# EAGLE design nrf24L01Shield (EAGLE 7.1.0)
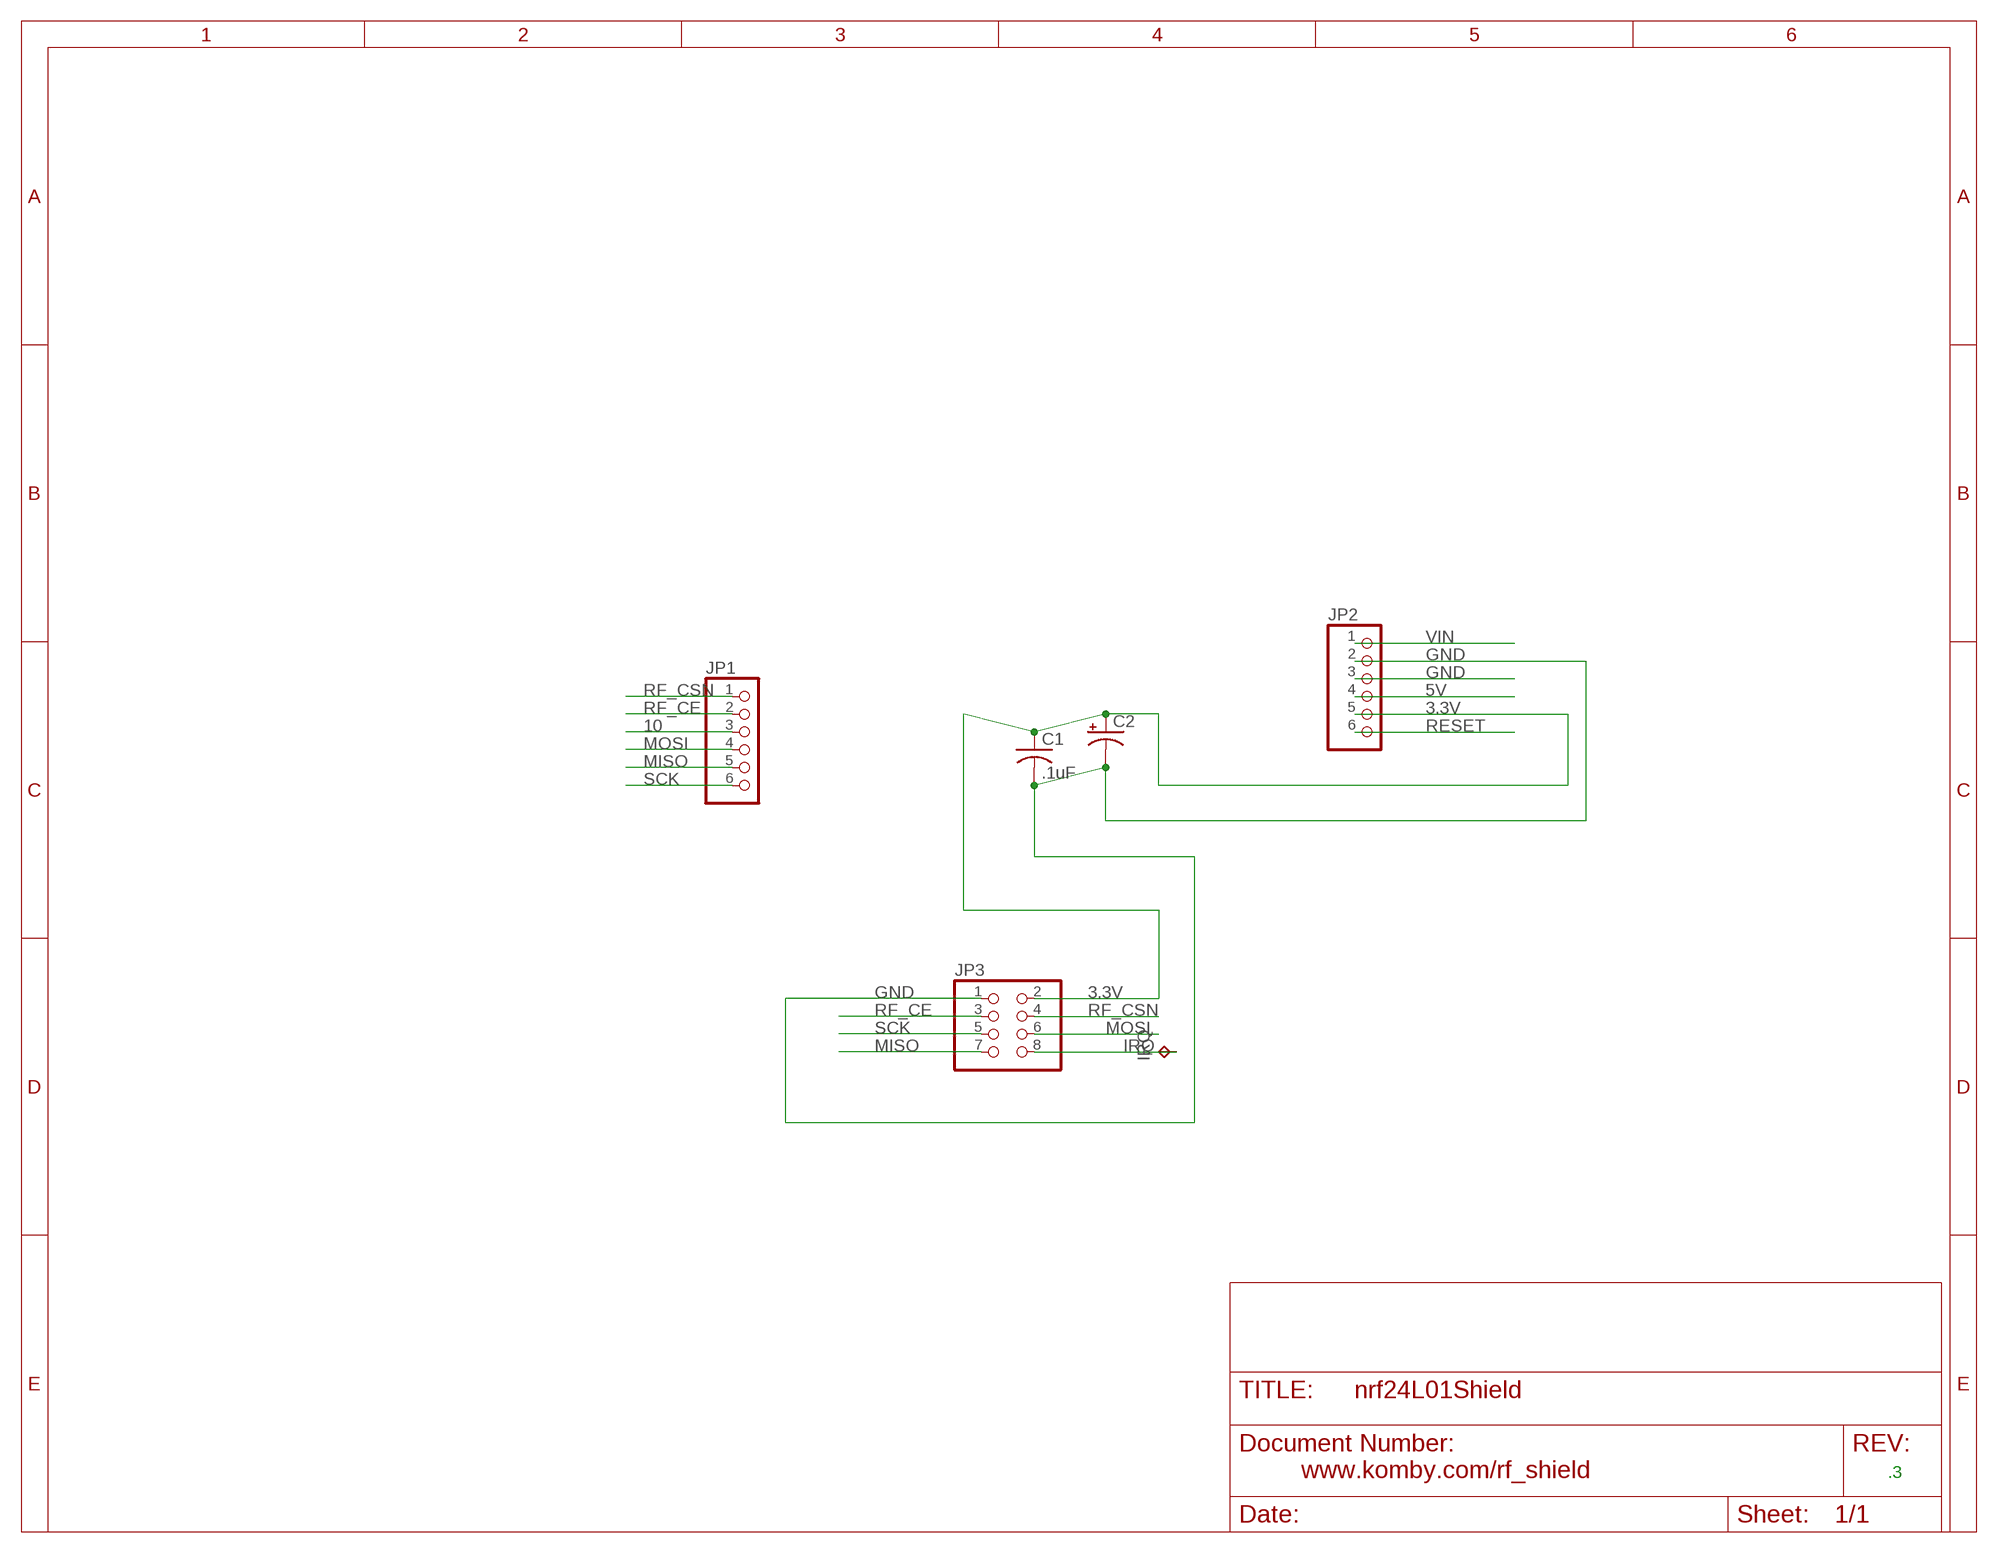
[diagram p0: schematic, sheet 1]

## Parts
C1  .1uF  C-US025-024X044  [C025-024X044]
C2  CPOL-USE2.5-6  [E2,5-6]
IRQ  IRQ  TPPAD1-13  [P1-13]
JP1  PINHD-1X6B  [1X06-BIG]
JP2  PINHD-1X6B  [1X06-BIG]
JP3  PINHD-2X4  [2X04]

## Nets
3.3V [RFBoard]: C1.1 C2.+ JP2.5 JP3.2
5V [RFBoard]: JP2.4
10 [RFBoard]: JP1.3
GND [RFBoard]: C1.2 C2.- JP2.2 JP2.3 JP3.1
IRQ: IRQ.TP JP3.8
MISO [RFBoard]: JP1.5 JP3.7
MOSI [RFBoard]: JP1.4 JP3.6
RESET [RFBoard]: JP2.6
RF_CE [RFBoard]: JP1.2 JP3.3
RF_CSN [RFBoard]: JP1.1 JP3.4
SCK [RFBoard]: JP1.6 JP3.5
VIN [RFBoard]: JP2.1

## Notes on the sheet
- www.komby.com/rf_shield | .3

## Library data of the parts
C1 = adafruit:C-US: CAPACITOR, American symbol
C2 = adafruit:CPOL-US: POLARIZED CAPACITOR, American symbol
IRQ = testpad:TP: Test pad
JP1 JP2 = adafruit:PINHD-1X6: PIN HEADER
JP3 = adafruit:PINHD-2X4: PIN HEADER

## Net classes
1 RFBoard: width 0.406 mm

## Board
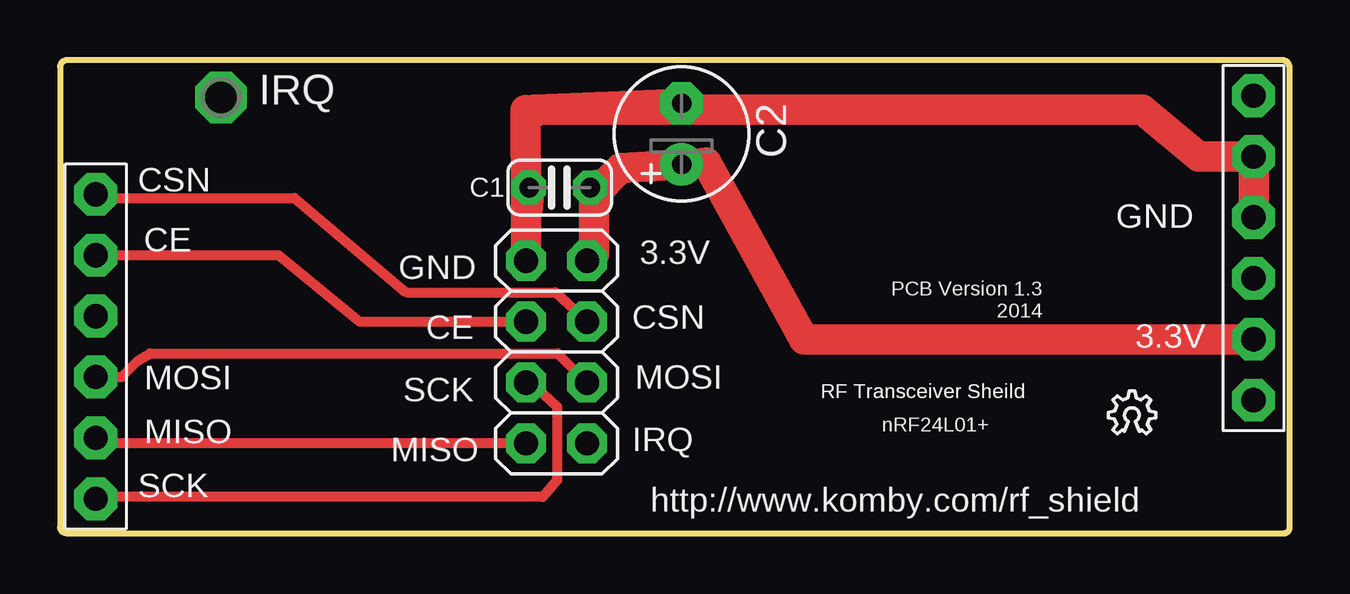
[diagram p1: board, top side]
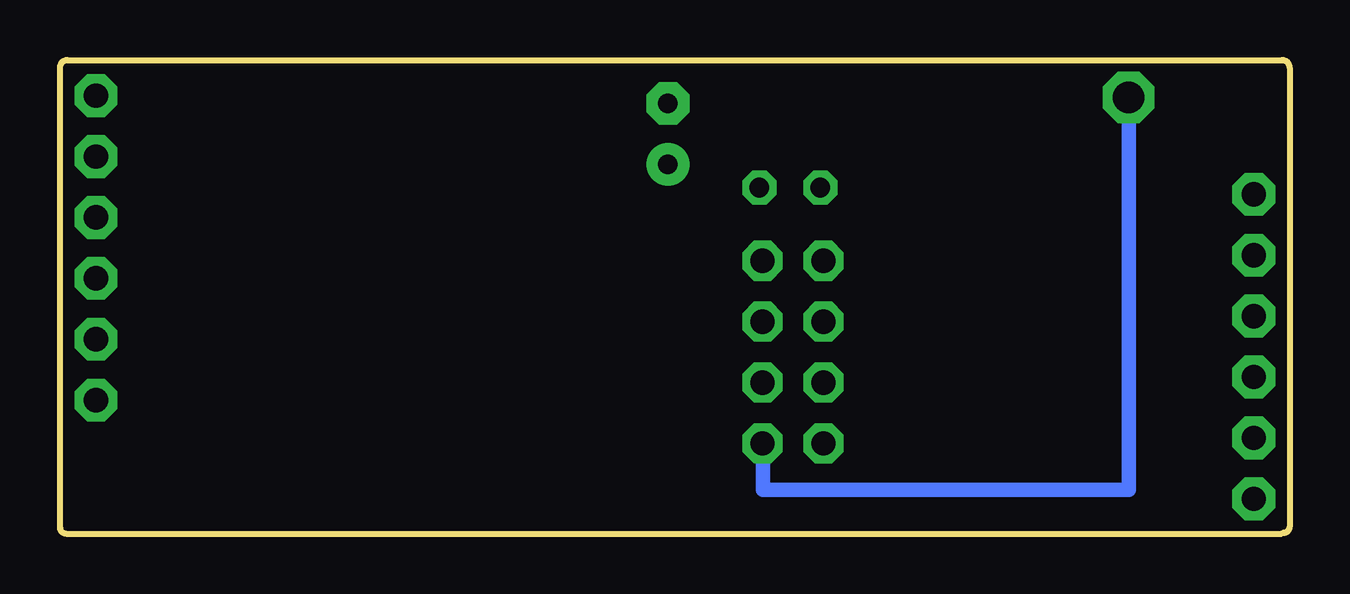
[diagram p2: board, bottom side, seen from below]

Size 51.25 x 19.75 mm. Coordinates in mm from the lower left corner, seen from the top.
Outline: 0.33,0 51,0 arc90 51.25,0.25 51.25,19.43 arc90 50.93,19.75 0.32,19.75 arc90 0,19.43 0,0.28 arc95 0.28,0.02
Copper layers (1*16): Top 0.035mm / dielectric 1.5mm / Bottom 0.035mm
Design rules "Fusion_eagle_rule_v1.1": minimum track width 6mil, minimum drill 12mil, track to track 6mil, track to pad 6mil, pad to pad 6mil, via to via 6mil, smd to smd 0mil, copper to edge 10mil, drill to drill 10mil, minimum pad ring 10mil, minimum via ring 6mil, stop-mask expansion 2mil, vias tented up to drill 100mil, thermal gap 10mil

### Footprints (pad centres in the part's own frame; a part is rotated, then mirrored left to right if it is on the bottom)
C025-024X044 = drill 0.813 pad 1.422 octagon: 1 -1.27,0; 2 1.27,0
E2,5-6 = drill 0.813 pad 1.778: + -1.27,0 | drill 0.813 pad 1.778 octagon: - 1.27,0
P1-13 = drill 1.321 pad 2.159 octagon: TP 0,0
1X06-BIG = drill 1.016 pad 1.778 octagon: 1 -6.35,0; 2 -3.81,0; 3 -1.27,0; 4 1.27,0; 5 3.81,0; 6 6.35,0
2X04 = drill 1.016 pad 1.676 octagon: 1 -3.81,-1.27; 2 -3.81,1.27; 3 -1.27,-1.27; 4 -1.27,1.27; 5 1.27,-1.27; 6 1.27,1.27; 7 3.81,-1.27; 8 3.81,1.27

### Placement (x,y rotation side)
C1  20.83,14.43 180 top
C2  25.91,16.66 90 top
IRQ  6.71,18.19 270 top
JP1  1.49,7.8 270 top
JP2  49.75,11.91 270 top
JP3  20.7,7.57 270 top
U$1  [OSHW_6X70_NOTEXT]  43.69,4.17 0 top

### Tracks (layer width: path | path; a pad name or v marks a point on that pad's centre or on a via)
3.3V
  Top 1.27: JP2.5 31.02,8.1 26.95,15.47 C2.+ 23.37,15.24 22.25,14.12 22.25,13.41 | 22.17,11.58 JP3.2 22.25,11.66 22.25,13.41 | C1.1 22.35,14.53 22.25,13.41
GND
  Top 1.27: JP2.3 JP2.2 47.48,15.72 45.11,17.68 19.76,17.68 | 19.42,13.71 19.41,17.66 19.51,17.58 19.81,17.58 19.76,17.68 | 19.42,13.71 JP3.1 | 19.76,17.68 C2.- | C1.2 19.52,13.61 19.42,13.71
IRQ
  Bottom 0.61: JP3.8 21.95,3.76 21.95,1.83 6.71,1.83 IRQ.TP
MISO
  Top 0.406: JP3.7 1.72,3.76 JP1.5
MOSI
  Top 0.406: JP1.4 2.57,6.53 3.25,7.21 3.76,7.52 20.75,7.52 JP3.6
RF_CE
  Top 0.406: JP1.2 9.12,11.61 12.5,8.84 19.22,8.84 JP3.3
RF_CSN
  Top 0.406: JP1.1 1.64,14 9.77,14 14.43,10.06 20.65,10.06 JP3.4
SCK
  Top 0.406: JP3.5 19.61,6.3 20.73,5.28 20.73,2.23 20.12,1.52 1.56,1.52 JP1.6

### Text on the board
tNames: CSN | GND | CE | GND | 3.3V | PCB Version 1.3 / 2014 | CE | CSN | 3.3V | SCK | MOSI | MOSI | RF Transceiver Sheild | RF Transceiver Sheild | MISO | MISO | nRF24L01+ | IRQ | SCK | http://www.komby.com/rf_shield